# EAGLE design ham_filter (EAGLE 9.6.2)
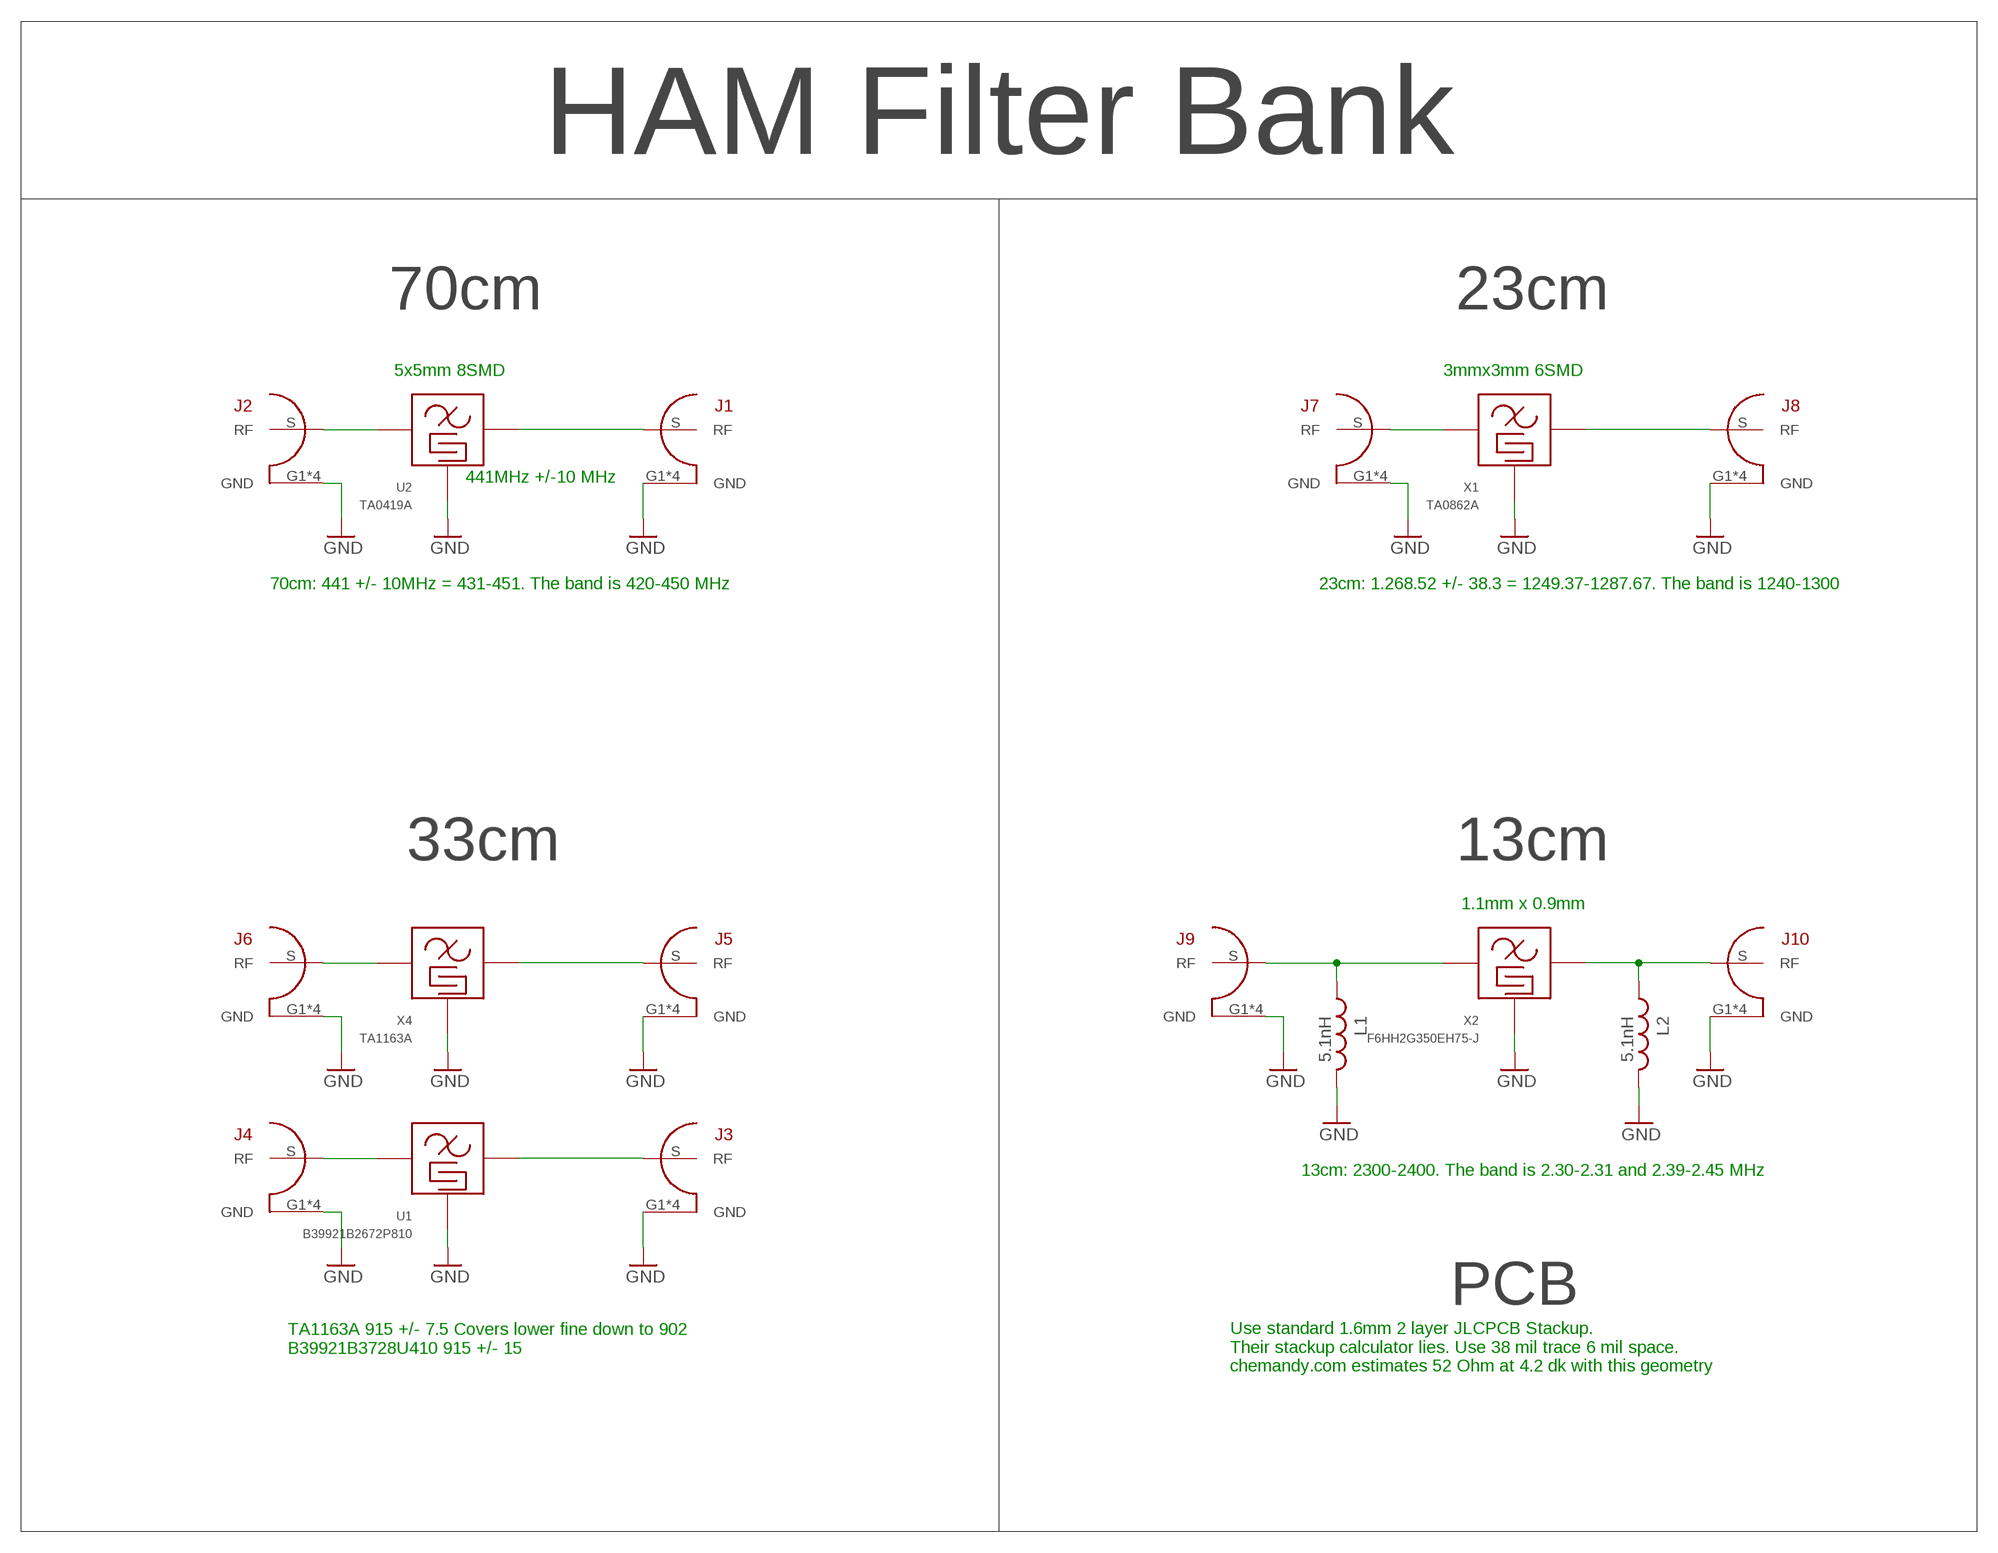
[diagram p0: schematic, sheet 1]

## Parts
J1  0733910070  [CONREVSMA008-G]
J2  0733910070  [CONREVSMA008-G]
J3  0733910070  [CONREVSMA008-G]
J4  0733910070  [CONREVSMA008-G]
J5  0733910070  [CONREVSMA008-G]
J6  0733910070  [CONREVSMA008-G]
J7  0733910070  [CONREVSMA008-G]
J8  0733910070  [CONREVSMA008-G]
J9  0733910070  [CONREVSMA008-G]
J10  0733910070  [CONREVSMA008-G]
L1  5.1nH  0402_INDUCTOR  [0402_INDUCTOR]
L2  5.1nH  0402_INDUCTOR  [0402_INDUCTOR]
U1  B39921B2672P810  [B2672]
U2  TA0419A  [TAO419]
X1  TA0862A  [TA0862A]
X2  F6HH2G350EH75-J  [EH75]
X4  TA1163A  TA0862A  [TA0862A]

## Nets
1I: J7.S(RF) X1.B
1O: J8.S(RF) X1.E
2I: J9.S(RF) L1.P$1 X2.1
2O: J10.S(RF) L2.P$1 X2.4
70BI: J6.S(RF) X4.B
70BO: J5.S(RF) X4.E
GND: J1.G1(GND) J1.G2(GND) J1.G3(GND) J1.G4(GND) J2.G1(GND) J2.G2(GND) J2.G3(GND) J2.G4(GND) J3.G1(GND) J3.G2(GND) J3.G3(GND) J3.G4(GND) J4.G1(GND) J4.G2(GND) J4.G3(GND) J4.G4(GND) J5.G1(GND) J5.G2(GND) J5.G3(GND) J5.G4(GND) J6.G1(GND) J6.G2(GND) J6.G3(GND) J6.G4(GND) J7.G1(GND) J7.G2(GND) J7.G3(GND) J7.G4(GND) J8.G1(GND) J8.G2(GND) J8.G3(GND) J8.G4(GND) J9.G1(GND) J9.G2(GND) J9.G3(GND) J9.G4(GND) J10.G1(GND) J10.G2(GND) J10.G3(GND) J10.G4(GND) L1.P$2 L2.P$2 U1.2(GND) U1.3(GND) U1.5(GND) U2.1(GND) U2.3(GND) U2.4(GND) U2.5(GND) U2.7(GND) U2.8(GND) X1.A(GND) X1.C(GND) X1.D(GND) X1.F(GND) X2.2(GND) X2.3(GND) X2.5(GND) X4.A(GND) X4.C(GND) X4.D(GND) X4.F(GND)
N$3: J2.S(RF) U2.2
N$8: J3.S(RF) U1.4
N$9: J4.S(RF) U1.1
N$21: J1.S(RF) U2.6

## Notes on the sheet
- HAM Filter Bank
- 70cm | 23cm
- 5x5mm 8SMD | 3mmx3mm 6SMD
- 441MHz +/-10 MHz
- 70cm: 441 +/- 10MHz = 431-451. The band is 420-450 MHz | 23cm: 1.268.52 +/- 38.3 = 1249.37-1287.67. The band is 1240-1300
- 33cm | 13cm
- 1.1mm x 0.9mm
- 13cm: 2300-2400. The band is 2.30-2.31 and 2.39-2.45 MHz
- PCB
- TA1163A 915 +/- 7.5 Covers lower fine down to 902
  B39921B3728U410 915 +/- 15
- Use standard 1.6mm 2 layer JLCPCB Stackup.
  Their stackup calculator lies. Use 38 mil trace 6 mil space.
  chemandy.com estimates 52 Ohm at 4.2 dk with this geometry

## Library data of the parts
J1-J10 = ruark2:0733910070: SMA Connector Receptacle, Female Socket 50Ohm Through Hole Solder; PARTNO: WM5544-ND
L1 L2 = ruark2:0402_INDUCTOR: select; VALUE: SEL
U1 = ruark2:B39921B2672P810: 915MHz Frequency General Purpose RF SAW Filter (Surface Acoustic Wave) 1.1dB 26MHz Bandwidth 5-SMD, No Lead; PARTNO: 1752-B39921B2672P810CT-ND
U2 = ruark2:TA0419A: 441MHz Frequency General Purpose RF SAW Filter (Surface Acoustic Wave) 1.5dB 19MHz Bandwidth 8-SMD, No Lead; PARTNO: 4606-TA0419ACT-ND
X1 X4 = ruark2:TA0862A: 1.26852GHz Frequency Wireless RF SAW Filter (Surface Acoustic Wave) 3.2dB 20.46MHz Bandwidth 6-SMD, No Lead; PARTNO: 4606-TA0862ACT-ND
X2 = ruark2:F6HH2G350EH75-J: 2.35GHz Frequency LTE, SCDMA RF SAW Filter (Surface Acoustic Wave) 1.4dB Bandwidth 5-SMD, No Lead; PARTNO: 587-F6HH2G350EH75-JCT-ND

## Board
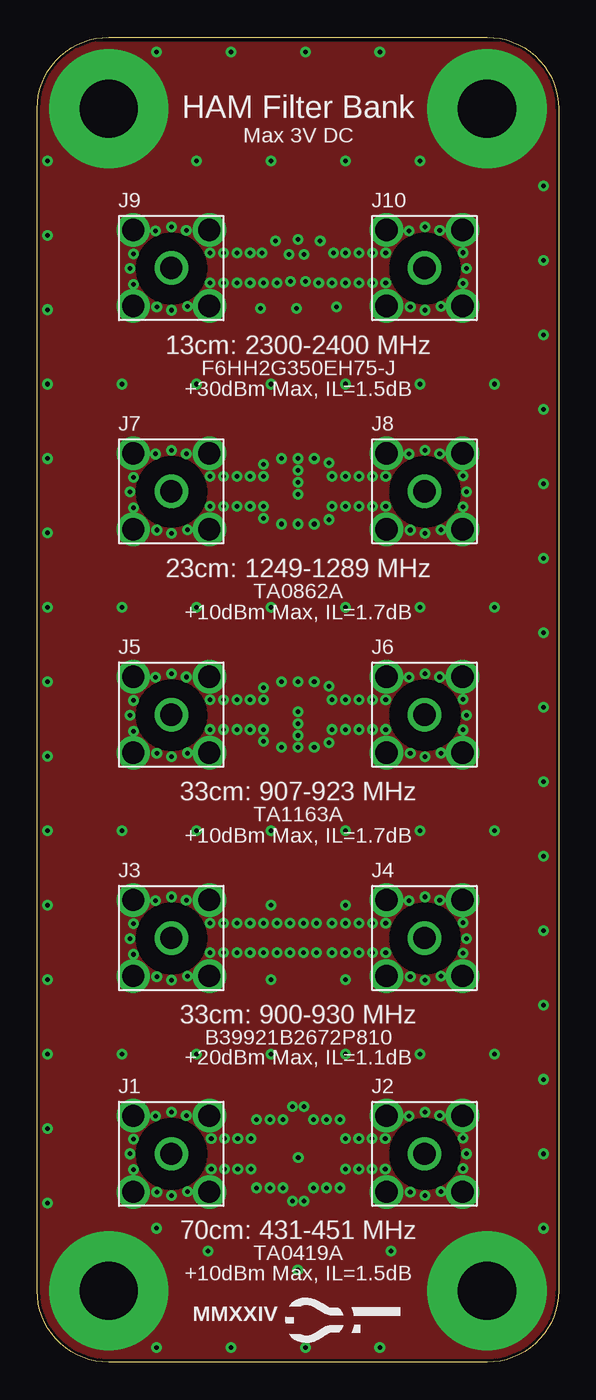
[diagram p1: board, top side]
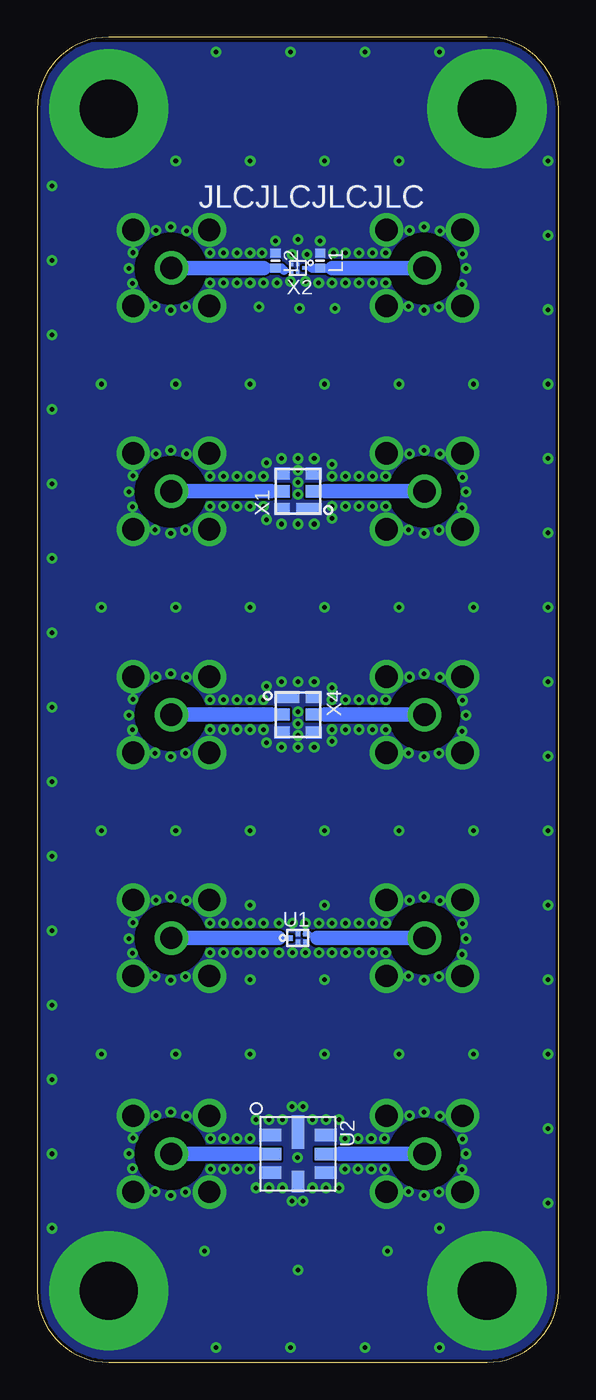
[diagram p2: board, bottom side, seen from below]

Size 35 x 89 mm. Coordinates in mm from the lower left corner, seen from the top.
Outline: 30.2,0 4.8,0 arc-90 0,4.8 0,84.2 arc-90 4.8,89 30.2,89 arc-90 35,84.2 35,4.8 arc-90 30.2,0
Copper layers (1*16): Top 0.035mm / dielectric 1.5mm / Bottom 0.035mm
Design rules "default *": minimum track width 5mil, minimum drill 12mil, track to track 6mil, track to pad 6mil, pad to pad 6mil, via to via 6mil, smd to smd 6mil, copper to edge 0.2mm, drill to drill 6mil, minimum pad ring 5mil, minimum via ring 8mil, stop-mask expansion 4mil, vias tented up to drill 12mil, thermal gap 10mil
tRestrict: area 23.7,11.7 to 28.3,16.3; area 6.7,11.7 to 11.3,16.3; area 23.7,11.7 to 28.3,16.3; area 23.7,26.2 to 28.3,30.7; area 6.7,26.2 to 11.3,30.7; area 23.7,26.2 to 28.3,30.7; area 23.7,41.2 to 28.3,45.7; area 6.7,41.2 to 11.3,45.7; area 23.7,41.2 to 28.3,45.7; area 23.7,56.2 to 28.3,60.7; area 6.7,56.2 to 11.3,60.7; area 23.7,56.2 to 28.3,60.7; 3 more areas
bRestrict: area 23.7,11.7 to 28.3,16.3; area 6.7,11.7 to 11.3,16.3; area 23.7,11.7 to 28.3,16.3; area 23.7,26.2 to 28.3,30.7; area 6.7,26.2 to 11.3,30.7; area 23.7,26.2 to 28.3,30.7; area 23.7,41.2 to 28.3,45.7; area 6.7,41.2 to 11.3,45.7; area 23.7,41.2 to 28.3,45.7; area 23.7,56.2 to 28.3,60.7; area 6.7,56.2 to 11.3,60.7; area 23.7,56.2 to 28.3,60.7; 3 more areas

### Footprints (pad centres in the part's own frame; a part is rotated, then mirrored left to right if it is on the bottom)
CONREVSMA008-G = drill 1.499: G1 -2.553,2.553; G2 2.553,2.553; G3 2.553,-2.553; G4 -2.553,-2.553; S 0,0
0402_INDUCTOR = smd 0.6 x 0.7: P$1 0.5,0; P$2 -0.5,0
B2672 = smd 0.3 x 0.375: 1 -0.5,0; 2 0,-0.287; 3 0.5,-0.287; 4 0.5,0.287; 5 0,0.287
TAO419 = smd 0.84 x 1.47: 1 -1.27,-1.865; 2 0,-1.865; 3 1.27,-1.865; 5 1.27,1.865; 6 0,1.865; 7 -1.27,1.865 | smd 1.47 x 0.84: 4 1.865,0 | smd 2.28 x 0.84: 8 -1.46,0
TA0862A = smd 0.81 x 1.7: A -1.191,-0.745 | smd 0.81 x 1.05: B 0,-1.07; C 1.19,-1.07; D 1.19,1.07; E 0,1.07; F -1.19,1.07
EH75 = smd 0.2 x 0.25: 1 -0.395,0; 2 0,-0.25; 3 0.395,-0.25; 4 0.395,0.25; 5 0,0.25

### Placement (x,y rotation side)
J1  9,14 0 top
J2  26,14 0 top
J3  9,28.5 0 top
J4  26,28.5 0 top
J5  9,43.5 0 top
J6  26,43.5 0 top
J7  9,58.5 0 top
J8  26,58.5 0 top
J9  9,73.5 0 top
J10  26,73.5 0 top
L1  16,74 270 bottom
L2  19,74 270 bottom
U1  17.5,28.5 0 bottom
U2  17.5,14 270 bottom
X1  17.5,58.5 90 bottom
X2  17.5,73.5 180 bottom
X4  17.5,43.5 270 bottom

### Tracks (layer width: path | path; a pad name or v marks a point on that pad's centre or on a via)
1I
  Bottom 0.8: 15.7,58.5 X1.B
  Bottom 0.965: J7.S 15.7,58.5
1O
  Bottom 0.8: 19.3,58.5 X1.E
  Bottom 0.965: J8.S 19.3,58.5
2I
  Bottom 0.2: X2.1 16.6,73.5
  Bottom 0.6: 15.2,73.5 L1.P$1 16.6,73.5
  Bottom 0.965: 15.2,73.5 J9.S
2O
  Bottom 0.152: 18.35,73.25 18.6,73.5
  Bottom 0.2: X2.4 18.35,73.25
  Bottom 0.6: 18.42,73.32 18.6,73.5 L2.P$1 19.8,73.5
  Bottom 0.965: J10.S 19.8,73.5
70BI
  Bottom 0.8: 19.3,43.5 X4.B
  Bottom 0.965: J6.S 19.3,43.5
70BO
  Bottom 0.8: 15.7,43.5 X4.E
  Bottom 0.965: J5.S 15.7,43.5
GND  (via drill 0.3, 3.9 pad 8)
  other vias: 9.02,16.8 10.01,16.57 7.95,16.54 11.68,15.02 12.57,15.02 11.68,12.99 12.57,12.99 6.22,14 6.45,14.99 6.48,12.94 9.02,11.21 8.03,11.44 10.08,11.46 14.35,15.02 13.46,15.02 13.46,12.99 14.35,12.99 17.53,13.75 14.73,11.72 16.51,11.72 15.62,11.72 15.62,16.29 16.51,16.29 14.73,16.29 26.04,11.21 25.04,11.44 27.1,11.46 23.37,12.99 22.48,12.99 23.37,15.02 22.48,15.02 28.83,14 28.6,13.01 28.57,15.07 26.04,16.8 27.03,16.57 24.97,16.54 20.7,12.99 21.59,12.99 21.59,15.02 20.7,15.02 20.32,16.29 18.54,16.29 19.43,16.29 19.43,11.72 18.54,11.72 20.32,11.72 17.91,17.18 17.14,17.18 17.91,10.83 17.14,10.83 9.02,31.26 10.01,31.03 7.95,31 11.6,29.5 12.5,29.5 11.6,27.5 12.5,27.5 6.22,28.46 6.45,29.45 6.48,27.4 9.02,25.67 8.03,25.9 10.08,25.92 14.3,29.5 13.4,29.5 13.4,27.5 14.3,27.5 26.04,25.67 25.04,25.9 27.1,25.92 23.4,27.5 22.5,27.5 23.4,29.5 22.5,29.5 28.83,28.46 28.6,27.47 28.57,29.53 26.04,31.26 27.03,31.03 24.97,31 20.7,27.5 21.6,27.5 21.6,29.5 20.7,29.5 15.2,29.5 15.2,27.5 19.8,29.5 19.8,27.5 9.02,46.26 10.01,46.03 7.95,46 11.6,44.5 12.5,44.5 11.6,42.5 12.5,42.5 6.22,43.46 6.45,44.45 6.48,42.4 9.02,40.67 8.03,40.9 10.08,40.92 14.3,44.5 13.4,44.5 13.4,42.5 14.3,42.5 26.04,40.67 25.04,40.9 27.1,40.92 23.4,42.5 22.5,42.5 23.4,44.5 22.5,44.5 28.83,43.46 28.6,42.47 28.57,44.53 26.04,46.26 27.03,46.03 24.97,46 20.7,42.5 21.6,42.5 21.6,44.5 20.7,44.5 15.2,44.5 15.2,42.5 15.2,45.3 16.4,45.7 17.5,45.7 18.6,45.7 15.2,41.7 16.4,41.3 17.5,41.3 18.6,41.3 19.8,44.5 19.8,42.5 19.6,41.6 19.6,45.4 9.02,61.26 10.01,61.03 7.95,61 11.6,59.5 12.5,59.5 11.6,57.5 12.5,57.5 6.22,58.46 6.45,59.45 6.48,57.4 9.02,55.67 8.03,55.9 10.08,55.92 14.3,59.5 13.4,59.5 13.4,57.5 14.3,57.5 26.04,55.67 25.04,55.9 27.1,55.92 23.4,57.5 22.5,57.5 23.4,59.5 22.5,59.5 28.83,58.46 28.6,57.47 28.57,59.53 26.04,61.26 27.03,61.03 24.97,61 20.7,57.5 21.6,57.5 21.6,59.5 20.7,59.5 15.2,59.5 15.2,57.5 15.2,60.3 16.4,60.7 17.5,60.7 18.6,60.7 15.2,56.7 16.4,56.3 17.5,56.3 18.6,56.3 19.8,59.5 19.8,57.5 19.6,56.6 19.6,60.4 9.02,76.26 10.01,76.03 7.95,76 11.6,74.5 12.5,74.5 11.6,72.5 12.5,72.5 6.22,73.46 6.45,74.45 6.48,72.4 9.02,70.67 8.03,70.9 10.08,70.92 14.3,74.5 13.4,74.5 13.4,72.5 14.3,72.5 26.04,70.67 25.04,70.9 27.1,70.92 23.4,72.5 22.5,72.5 23.4,74.5 22.5,74.5 28.83,73.46 28.6,72.47 28.57,74.53 26.04,76.26 27.03,76.03 24.97,76 20.7,72.5 21.6,72.5 21.6,74.5 20.7,74.5 15.1,74.5 15.2,72.5 19.9,74.5 19.8,72.5 16,75.33 16.9,74.4 17.9,74.4 19,75.32 16.1,72.5 17,72.6 18,72.6 18.9,72.5 4.8,4.8 30.2,4.8 30.2,84.2 4.8,84.2 0.7,80.7 0.7,75.7 0.7,70.7 0.7,65.7 0.7,60.7 0.7,55.7 0.7,50.7 0.7,45.7 0.7,40.7 0.7,35.7 0.7,30.7 0.7,25.7 0.7,20.7 0.7,15.7 0.7,10.7 5.7,20.7 10.7,20.7 15.7,20.7 20.7,20.7 25.7,20.7 30.7,20.7 5.7,35.7 10.7,35.7 15.7,35.7 20.7,35.7 25.7,35.7 30.7,35.7 5.7,65.7 10.7,65.7 15.7,65.7 20.7,65.7 25.7,65.7 30.7,65.7 5.7,50.7 10.7,50.7 15.7,50.7 20.7,50.7 25.7,50.7 30.7,50.7 10.7,80.7 15.7,80.7 20.7,80.7 25.7,80.7 8,1 8,9 34,9 11.48,7.48 17.49,6.21 23.76,7.48 13,1 18,1 23,1 34,14 34,19 34,24 34,29 34,34 34,39 34,44 34,49 34,54 34,59 34,64 34,69 34,79 34,74 8,88 13,88 18,88 23,88 17.5,59.1 17.5,42.9 17.5,75.43 15,70.8 17.4,70.8 20.1,70.9 17.5,58.3 17.5,43.7 17.5,42.1 17.5,59.9 16.09,29.5 16.98,29.5 17.87,29.5 18.76,29.5 16.09,27.5 16.98,27.5 17.87,27.5 18.76,27.5 15.7,30.7 20.7,30.7 15.7,25.7 20.7,25.7
  pour Top (rank 5, no thermals): 35,0 35,88.56 0.06,88.56 0.06,0
  pour Bottom (rank 3, no thermals): 35,0 35,88.56 0.06,88.56 0.06,0
N$3
  Bottom 0.8: 20.3,14 U2.2
  Bottom 0.965: J2.S 20.3,14
N$8
  Bottom 0.381: U1.4 16.72,28.79 16.43,28.5 16.21,28.5
  Bottom 0.965: 16.21,28.5 J3.S
N$9
  Bottom 0.381: U1.1 18.79,28.5
  Bottom 0.965: 18.79,28.5 J4.S
N$21
  Bottom 0.8: 14.7,14 U2.6
  Bottom 0.965: J1.S 14.7,14

### Text on the board
tPlace: HAM Filter Bank | Max 3V DC | 13cm: 2300-2400 MHz | F6HH2G350EH75-J | +30dBm Max, IL=1.5dB | 23cm: 1249-1289 MHz | TA0862A | +10dBm Max, IL=1.7dB | 33cm: 907-923 MHz | TA1163A | +10dBm Max, IL=1.7dB | 33cm: 900-930 MHz | B39921B2672P810 | +20dBm Max, IL=1.1dB | 70cm: 431-451 MHz | TA0419A | +10dBm Max, IL=1.5dB | MMXXIV
bNames: JLCJLCJLCJLC
tStop: 029